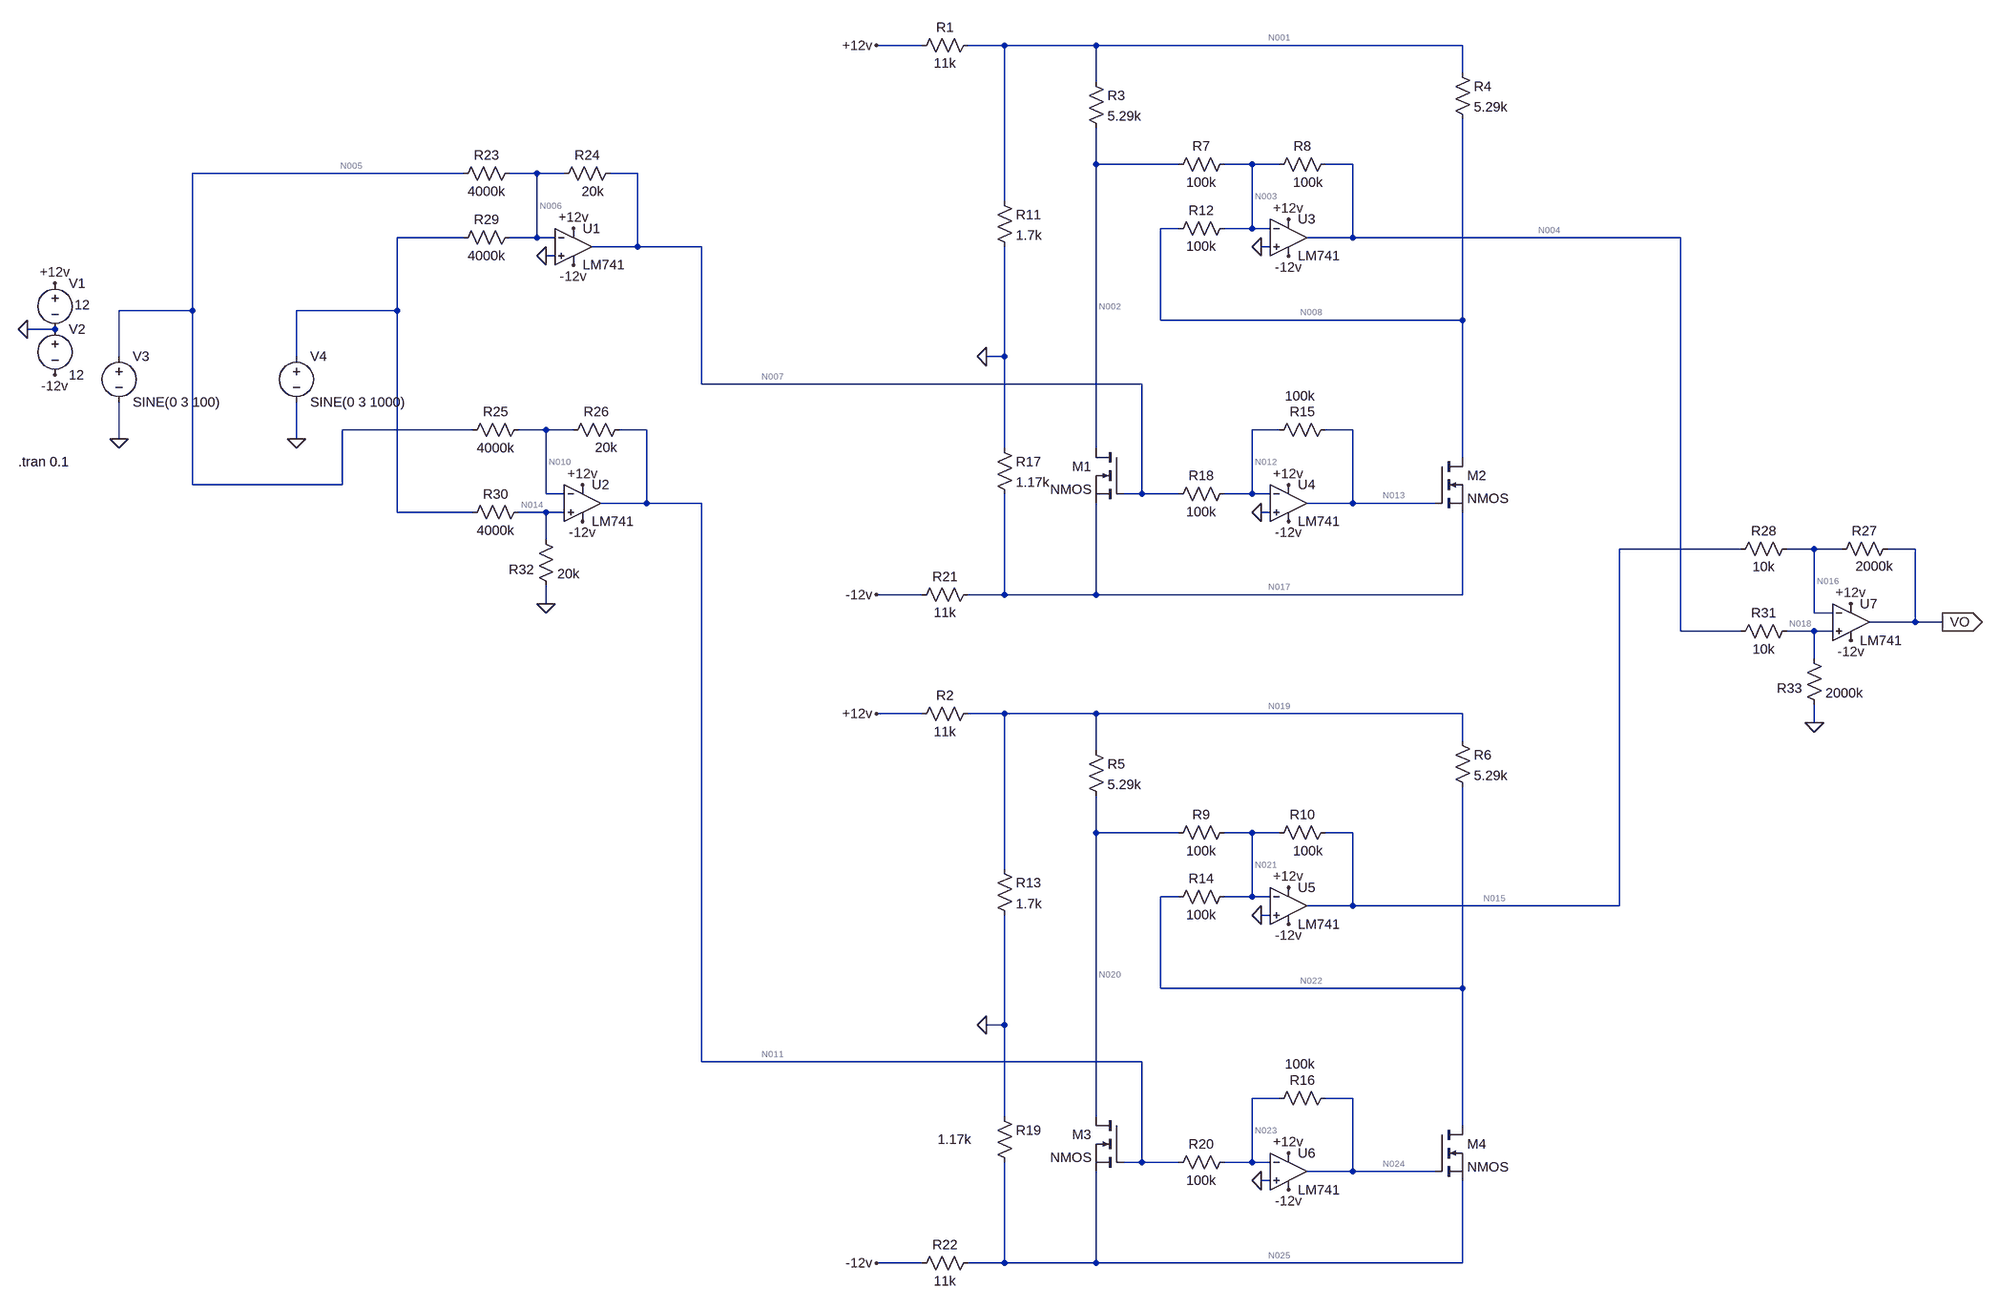
[diagram p0: schematic Multiplier_squaring.asc]
Multiplier_squaring.asc, the LTspice schematic file:
Version 4
SHEET 1 3564 2076
WIRE 1408 -240 1328 -240
WIRE 1552 -240 1488 -240
WIRE 1712 -240 1552 -240
WIRE 2352 -240 1712 -240
WIRE 2352 -192 2352 -240
WIRE 1712 -176 1712 -240
WIRE 1712 -32 1712 -96
WIRE 1856 -32 1712 -32
WIRE 1984 -32 1936 -32
WIRE 2032 -32 1984 -32
WIRE 2160 -32 2112 -32
WIRE -48 -16 -720 -16
WIRE 80 -16 32 -16
WIRE 128 -16 80 -16
WIRE 256 -16 208 -16
WIRE 1552 32 1552 -240
WIRE 1856 80 1824 80
WIRE 1984 80 1984 -32
WIRE 1984 80 1936 80
WIRE 2016 80 1984 80
WIRE -48 96 -304 96
WIRE 80 96 80 -16
WIRE 80 96 32 96
WIRE 112 96 80 96
WIRE 2160 96 2160 -32
WIRE 2160 96 2080 96
WIRE 2848 96 2160 96
WIRE 256 112 256 -16
WIRE 256 112 176 112
WIRE 368 112 256 112
WIRE 2016 112 2000 112
WIRE 112 128 96 128
WIRE -720 224 -720 -16
WIRE -720 224 -848 224
WIRE -304 224 -304 96
WIRE -304 224 -480 224
WIRE 1824 240 1824 80
WIRE 2352 240 2352 -112
WIRE 2352 240 1824 240
WIRE -960 256 -1008 256
WIRE -848 304 -848 224
WIRE -480 304 -480 224
WIRE 1552 304 1552 112
WIRE 1552 304 1520 304
WIRE 368 352 368 112
WIRE 1792 352 368 352
WIRE -32 432 -400 432
WIRE 96 432 48 432
WIRE 144 432 96 432
WIRE 272 432 224 432
WIRE 2032 432 1984 432
WIRE 2160 432 2112 432
WIRE -848 448 -848 384
WIRE -480 448 -480 384
WIRE 1552 464 1552 304
WIRE 1712 464 1712 -32
WIRE 2352 480 2352 240
WIRE -720 528 -720 224
WIRE -400 528 -400 432
WIRE -400 528 -720 528
WIRE 96 544 96 432
WIRE 128 544 96 544
WIRE 1792 544 1792 352
WIRE 1792 544 1760 544
WIRE 1856 544 1792 544
WIRE 1984 544 1984 432
WIRE 1984 544 1936 544
WIRE 2016 544 1984 544
WIRE 272 560 272 432
WIRE 272 560 192 560
WIRE 368 560 272 560
WIRE 2160 560 2160 432
WIRE 2160 560 2080 560
WIRE 2304 560 2160 560
WIRE -304 576 -304 224
WIRE -32 576 -304 576
WIRE 96 576 48 576
WIRE 128 576 96 576
WIRE 2016 576 2000 576
WIRE 96 624 96 576
WIRE 3120 640 2656 640
WIRE 3248 640 3200 640
WIRE 3296 640 3248 640
WIRE 3424 640 3376 640
WIRE 1408 720 1328 720
WIRE 1552 720 1552 544
WIRE 1552 720 1488 720
WIRE 1712 720 1712 560
WIRE 1712 720 1552 720
WIRE 2352 720 2352 576
WIRE 2352 720 1712 720
WIRE 96 736 96 704
WIRE 3248 752 3248 640
WIRE 3280 752 3248 752
WIRE 3424 768 3424 640
WIRE 3424 768 3344 768
WIRE 3472 768 3424 768
WIRE 2848 784 2848 96
WIRE 3120 784 2848 784
WIRE 3248 784 3200 784
WIRE 3280 784 3248 784
WIRE 3248 832 3248 784
WIRE 1408 928 1328 928
WIRE 1552 928 1488 928
WIRE 1712 928 1552 928
WIRE 2352 928 1712 928
WIRE 3248 944 3248 912
WIRE 2352 976 2352 928
WIRE 1712 992 1712 928
WIRE 1712 1136 1712 1072
WIRE 1856 1136 1712 1136
WIRE 1984 1136 1936 1136
WIRE 2032 1136 1984 1136
WIRE 2160 1136 2112 1136
WIRE 1552 1200 1552 928
WIRE 1856 1248 1824 1248
WIRE 1984 1248 1984 1136
WIRE 1984 1248 1936 1248
WIRE 2016 1248 1984 1248
WIRE 2160 1264 2160 1136
WIRE 2160 1264 2080 1264
WIRE 2656 1264 2656 640
WIRE 2656 1264 2160 1264
WIRE 2016 1280 2000 1280
WIRE 1824 1408 1824 1248
WIRE 2352 1408 2352 1056
WIRE 2352 1408 1824 1408
WIRE 1552 1472 1552 1280
WIRE 1552 1472 1520 1472
WIRE 368 1536 368 560
WIRE 1792 1536 368 1536
WIRE 2032 1600 1984 1600
WIRE 2160 1600 2112 1600
WIRE 1552 1632 1552 1472
WIRE 1712 1632 1712 1136
WIRE 2352 1648 2352 1408
WIRE 1792 1712 1792 1536
WIRE 1792 1712 1760 1712
WIRE 1856 1712 1792 1712
WIRE 1984 1712 1984 1600
WIRE 1984 1712 1936 1712
WIRE 2016 1712 1984 1712
WIRE 2160 1728 2160 1600
WIRE 2160 1728 2080 1728
WIRE 2304 1728 2160 1728
WIRE 2016 1744 2000 1744
WIRE 1408 1888 1328 1888
WIRE 1552 1888 1552 1712
WIRE 1552 1888 1488 1888
WIRE 1712 1888 1712 1728
WIRE 1712 1888 1552 1888
WIRE 2352 1888 2352 1744
WIRE 2352 1888 1712 1888
FLAG 96 128 0
FLAG -1008 256 0
FLAG -960 176 +12v
FLAG -960 336 -12v
FLAG 144 80 +12v
FLAG 144 144 -12v
FLAG 160 528 +12v
FLAG 160 592 -12v
FLAG 96 736 0
FLAG -848 448 0
FLAG -480 448 0
FLAG 2000 112 0
FLAG 2048 64 +12v
FLAG 2048 128 -12v
FLAG 2000 576 0
FLAG 2048 528 +12v
FLAG 2048 592 -12v
FLAG 1520 304 0
FLAG 1328 720 -12v
FLAG 1328 -240 +12v
FLAG 2000 1280 0
FLAG 2048 1232 +12v
FLAG 2048 1296 -12v
FLAG 2000 1744 0
FLAG 2048 1696 +12v
FLAG 2048 1760 -12v
FLAG 1520 1472 0
FLAG 1328 1888 -12v
FLAG 1328 928 +12v
FLAG 3312 736 +12v
FLAG 3312 800 -12v
FLAG 3248 944 0
FLAG 3472 768 VO
IOPIN 3472 768 Out
SYMBOL OpAmps\\LM741 144 48 R0
SYMATTR InstName U1
SYMBOL res 224 -32 R90
WINDOW 0 0 56 VBottom 2
WINDOW 3 32 46 VTop 2
SYMATTR InstName R24
SYMATTR Value 20k
SYMBOL res 48 -32 R90
WINDOW 0 0 56 VBottom 2
WINDOW 3 32 56 VTop 2
SYMATTR InstName R23
SYMATTR Value 4000k
SYMBOL res 48 80 R90
WINDOW 0 0 56 VBottom 2
WINDOW 3 32 56 VTop 2
SYMATTR InstName R29
SYMATTR Value 4000k
SYMBOL voltage -960 160 R0
WINDOW 123 0 0 Left 0
WINDOW 39 0 0 Left 0
WINDOW 3 34 54 Left 2
SYMATTR Value 12
SYMATTR InstName V1
SYMBOL voltage -960 240 R0
WINDOW 123 0 0 Left 0
WINDOW 39 0 0 Left 0
SYMATTR InstName V2
SYMATTR Value 12
SYMBOL OpAmps\\LM741 160 496 R0
SYMATTR InstName U2
SYMBOL res 240 416 R90
WINDOW 0 0 56 VBottom 2
WINDOW 3 31 39 VTop 2
SYMATTR InstName R26
SYMATTR Value 20k
SYMBOL res 64 416 R90
WINDOW 0 0 56 VBottom 2
WINDOW 3 32 56 VTop 2
SYMATTR InstName R25
SYMATTR Value 4000k
SYMBOL res 64 560 R90
WINDOW 0 0 56 VBottom 2
WINDOW 3 32 56 VTop 2
SYMATTR InstName R30
SYMATTR Value 4000k
SYMBOL res 80 608 R0
WINDOW 0 -49 68 Left 2
SYMATTR InstName R32
SYMATTR Value 20k
SYMBOL voltage -848 288 R0
WINDOW 123 0 0 Left 0
WINDOW 39 0 0 Left 0
SYMATTR InstName V3
SYMATTR Value SINE(0 3 100)
SYMBOL voltage -480 288 R0
WINDOW 123 0 0 Left 0
WINDOW 39 0 0 Left 0
SYMATTR InstName V4
SYMATTR Value SINE(0 3 1000)
SYMBOL OpAmps\\LM741 2048 32 R0
SYMATTR InstName U3
SYMBOL res 2128 -48 R90
WINDOW 0 0 56 VBottom 2
WINDOW 3 32 46 VTop 2
SYMATTR InstName R8
SYMATTR Value 100k
SYMBOL res 1952 -48 R90
WINDOW 0 0 56 VBottom 2
WINDOW 3 32 56 VTop 2
SYMATTR InstName R7
SYMATTR Value 100k
SYMBOL res 1952 64 R90
WINDOW 0 0 56 VBottom 2
WINDOW 3 32 56 VTop 2
SYMATTR InstName R12
SYMATTR Value 100k
SYMBOL res 2336 -208 R0
SYMATTR InstName R4
SYMATTR Value 5.29k
SYMBOL res 1504 -256 R90
WINDOW 0 0 56 VBottom 2
WINDOW 3 32 56 VTop 2
SYMATTR InstName R1
SYMATTR Value 11k
SYMBOL res 1696 -192 R0
SYMATTR InstName R3
SYMATTR Value 5.29k
SYMBOL res 1536 16 R0
SYMATTR InstName R11
SYMATTR Value 1.7k
SYMBOL OpAmps\\LM741 2048 496 R0
SYMATTR InstName U4
SYMBOL res 2128 416 R90
WINDOW 0 0 56 VBottom 2
WINDOW 3 -59 60 VTop 2
SYMATTR InstName R15
SYMATTR Value 100k
SYMBOL res 1952 528 R90
WINDOW 0 0 56 VBottom 2
WINDOW 3 32 56 VTop 2
SYMATTR InstName R18
SYMATTR Value 100k
SYMBOL nmos 1760 464 M0
SYMATTR InstName M1
SYMBOL nmos 2304 480 R0
SYMATTR InstName M2
SYMBOL res 1504 704 R90
WINDOW 0 0 56 VBottom 2
WINDOW 3 32 56 VTop 2
SYMATTR InstName R21
SYMATTR Value 11k
SYMBOL res 1536 448 R0
SYMATTR InstName R17
SYMATTR Value 1.17k
SYMBOL OpAmps\\LM741 2048 1200 R0
SYMATTR InstName U5
SYMBOL res 2128 1120 R90
WINDOW 0 0 56 VBottom 2
WINDOW 3 32 46 VTop 2
SYMATTR InstName R10
SYMATTR Value 100k
SYMBOL res 1952 1120 R90
WINDOW 0 0 56 VBottom 2
WINDOW 3 32 56 VTop 2
SYMATTR InstName R9
SYMATTR Value 100k
SYMBOL res 1952 1232 R90
WINDOW 0 0 56 VBottom 2
WINDOW 3 32 56 VTop 2
SYMATTR InstName R14
SYMATTR Value 100k
SYMBOL res 2336 960 R0
SYMATTR InstName R6
SYMATTR Value 5.29k
SYMBOL res 1504 912 R90
WINDOW 0 0 56 VBottom 2
WINDOW 3 32 56 VTop 2
SYMATTR InstName R2
SYMATTR Value 11k
SYMBOL res 1696 976 R0
SYMATTR InstName R5
SYMATTR Value 5.29k
SYMBOL res 1536 1184 R0
SYMATTR InstName R13
SYMATTR Value 1.7k
SYMBOL OpAmps\\LM741 2048 1664 R0
SYMATTR InstName U6
SYMBOL res 2128 1584 R90
WINDOW 0 0 56 VBottom 2
WINDOW 3 -59 60 VTop 2
SYMATTR InstName R16
SYMATTR Value 100k
SYMBOL res 1952 1696 R90
WINDOW 0 0 56 VBottom 2
WINDOW 3 32 56 VTop 2
SYMATTR InstName R20
SYMATTR Value 100k
SYMBOL nmos 1760 1632 M0
SYMATTR InstName M3
SYMBOL nmos 2304 1648 R0
SYMATTR InstName M4
SYMBOL res 1504 1872 R90
WINDOW 0 0 56 VBottom 2
WINDOW 3 32 56 VTop 2
SYMATTR InstName R22
SYMATTR Value 11k
SYMBOL res 1536 1616 R0
WINDOW 3 -101 56 Left 2
SYMATTR Value 1.17k
SYMATTR InstName R19
SYMBOL OpAmps\\LM741 3312 704 R0
SYMATTR InstName U7
SYMBOL res 3392 624 R90
WINDOW 0 0 56 VBottom 2
WINDOW 3 31 39 VTop 2
SYMATTR InstName R27
SYMATTR Value 2000k
SYMBOL res 3216 624 R90
WINDOW 0 0 56 VBottom 2
WINDOW 3 32 56 VTop 2
SYMATTR InstName R28
SYMATTR Value 10k
SYMBOL res 3216 768 R90
WINDOW 0 0 56 VBottom 2
WINDOW 3 32 56 VTop 2
SYMATTR InstName R31
SYMATTR Value 10k
SYMBOL res 3232 816 R0
WINDOW 0 -49 68 Left 2
SYMATTR InstName R33
SYMATTR Value 2000k
TEXT -1024 488 Left 2 !.tran 0.1

The netlist it stands for:
* Multiplier_squaring.asc
XU1 0 N006 +12v -12v N007 LM741  ; pins In+ In- V+ V- OUT
R24 N007 N006 20k
R23 N006 N005 4000k
R29 N006 N009 4000k
V1 +12v 0 12
V2 0 -12v 12
XU2 N014 N010 +12v -12v N011 LM741  ; pins In+ In- V+ V- OUT
R26 N011 N010 20k
R25 N010 N005 4000k
R30 N014 N009 4000k
R32 N014 0 20k
V3 N005 0 SINE(0 3 100)
V4 N009 0 SINE(0 3 1000)
XU3 0 N003 +12v -12v N004 LM741  ; pins In+ In- V+ V- OUT
R8 N004 N003 100k
R7 N003 N002 100k
R12 N003 N008 100k
R4 N001 N008 5.29k
R1 N001 +12v 11k
R3 N001 N002 5.29k
R11 N001 0 1.7k
XU4 0 N012 +12v -12v N013 LM741  ; pins In+ In- V+ V- OUT
R15 N013 N012 100k
R18 N012 N007 100k
M1 N002 N007 N017 N017 NMOS
M2 N008 N013 N017 N017 NMOS
R21 N017 -12v 11k
R17 0 N017 1.17k
XU5 0 N021 +12v -12v N015 LM741  ; pins In+ In- V+ V- OUT
R10 N015 N021 100k
R9 N021 N020 100k
R14 N021 N022 100k
R6 N019 N022 5.29k
R2 N019 +12v 11k
R5 N019 N020 5.29k
R13 N019 0 1.7k
XU6 0 N023 +12v -12v N024 LM741  ; pins In+ In- V+ V- OUT
R16 N024 N023 100k
R20 N023 N011 100k
M3 N020 N011 N025 N025 NMOS
M4 N022 N024 N025 N025 NMOS
R22 N025 -12v 11k
R19 0 N025 1.17k
XU7 N018 N016 +12v -12v VO LM741  ; pins In+ In- V+ V- OUT
R27 VO N016 2000k
R28 N016 N015 10k
R31 N018 N004 10k
R33 N018 0 2000k
.model NMOS NMOS
.model PMOS PMOS
.lib standard.mos
.tran 0.1
.lib LM741.lib
.backanno
.end

* Results of the author's LTspice run, read from the files saved beside the schematic
* Operating Point, zero values left out:
*   V(n006) = 1 mV
*   V(-12v) = -12 V
*   V(+12v) = 12 V
*   V(n007) = 3.047 mV
*   V(n010) = -151.5 µV
*   V(n014) = -1.151 mV
*   V(n011) = 1.885 mV
*   V(n003) = 1.015 mV
*   V(n004) = -2.955 V
*   V(n002) = 1.484 V
*   V(n008) = 1.484 V
*   V(n001) = 1.563 V
*   V(n012) = 1 mV
*   V(n013) = 9.139 mV
*   V(n017) = -1.154 V
*   V(n021) = 1.015 mV
*   V(n015) = -2.955 V
*   V(n020) = 1.484 V
*   V(n022) = 1.484 V
*   V(n019) = 1.563 V
*   V(n023) = 1 mV
*   V(n024) = 10.3 mV
*   V(n025) = -1.154 V
*   V(n016) = -2.94 V
*   V(n018) = -2.941 V
*   V(vo) = 269.3 mV
*   Id(M1) = 4.114 pA
*   Is(M1) = -4.114 pA
*   Id(M2) = 4.114 pA
*   Is(M2) = -4.114 pA
*   Id(M3) = 4.114 pA
*   Is(M3) = -4.114 pA
*   Id(M4) = 4.114 pA
*   Is(M4) = -4.114 pA
*   I(R24) = 102.4 nA
*   I(R23) = 250 pA
*   I(R29) = 250 pA
*   I(R26) = 101.8 nA
*   I(R25) = -37.87 pA
*   I(R30) = -287.9 pA
*   I(R32) = -57.57 nA
*   I(R8) = -29.56 µA
*   I(R7) = -14.83 µA
*   I(R12) = -14.83 µA
*   I(R4) = 14.83 µA
*   I(R1) = -948.9 µA
*   I(R3) = 14.83 µA
*   I(R11) = 919.2 µA
*   I(R15) = 81.39 nA
*   I(R18) = -20.47 nA
*   I(R21) = 986 µA
*   I(R17) = 986 µA
*   I(R10) = -29.56 µA
*   I(R9) = -14.83 µA
*   I(R14) = -14.83 µA
*   I(R6) = 14.83 µA
*   I(R2) = -948.9 µA
*   I(R5) = 14.83 µA
*   I(R13) = 919.2 µA
*   I(R16) = 93.01 nA
*   I(R20) = -8.85 nA
*   I(R22) = 986 µA
*   I(R19) = 986 µA
*   I(R27) = 1.605 µA
*   I(R28) = 1.503 µA
*   I(R31) = 1.412 µA
*   I(R33) = -1.47 µA
*   I(V1) = -13.25 mA
*   I(V2) = -13.39 mA
*   I(V3) = 212.1 pA
*   I(V4) = -37.87 pA
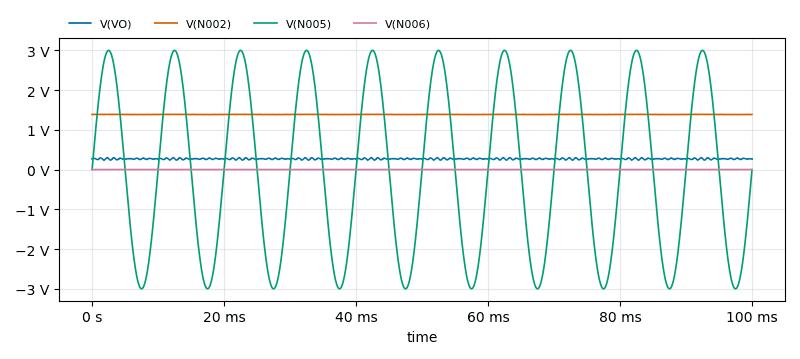
[diagram p1: Transient Analysis of Multiplier_squaring.asc, plotted from the saved traces]
* Transient Analysis, 1 run:
*   V(VO): min 238.3 mV, max 300.4 mV, average 270.3 mV, rms 270.6 mV, last 266.5 mV
*   V(N002): min 1.383 V, max 1.39 V, average 1.387 V, rms 1.387 V, last 1.387 V
*   V(N005): min -3 V, max 3 V, average -866.8 nV, rms 2.121 V, last 0 V
*   V(N006): min 983.7 µV, max 1.023 mV, average 1 mV, rms 1 mV, last 1.017 mV